# Altium schematic sheet Lockin.SchDoc
size A3; SheetNumber: 3; SheetTotal: 3
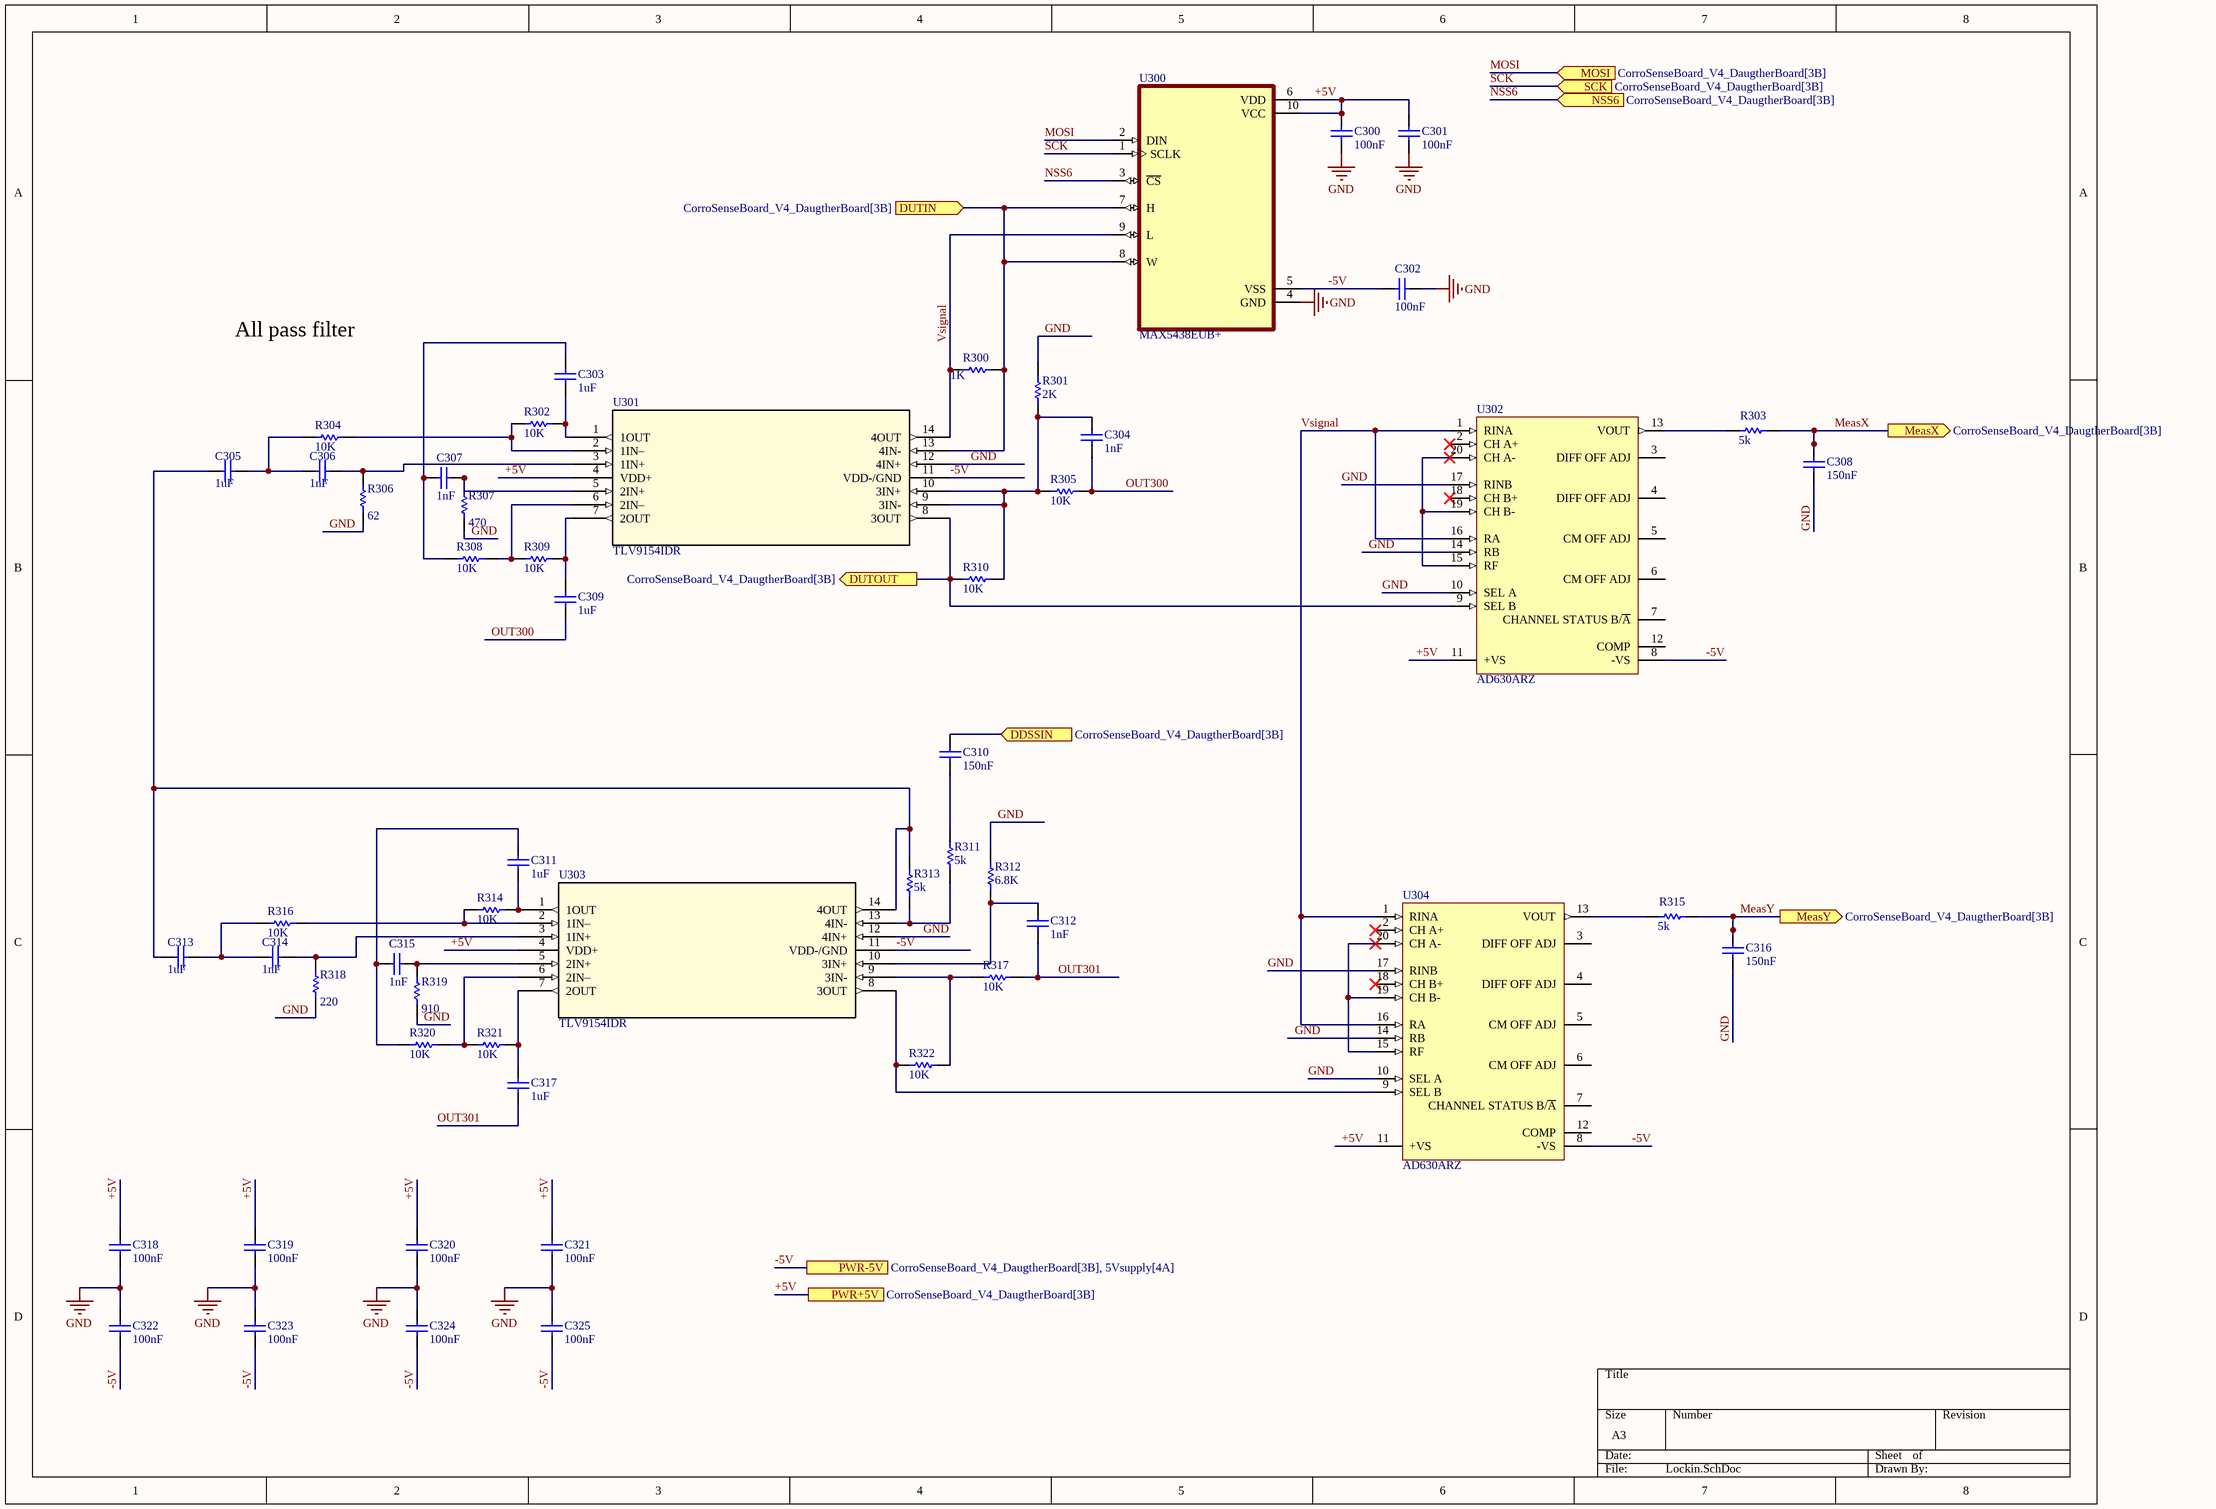
[diagram p0: Lockin.SchDoc]

## Parts
C300  100nF  [1608[0603]]
C301  100nF  [1608[0603]]
C302  100nF  [1608[0603]]
C303  1uF  [1608[0603]]
C304  1nF  [1608[0603]]
C305  1uF  [1608[0603]]
C306  1nF  [1608[0603]]
C307  1nF  [1608[0603]]
C308  150nF  [1608[0603]]
C309  1uF  [1608[0603]]
C310  150nF  [1608[0603]]
C311  1uF  [1608[0603]]
C312  1nF  [1608[0603]]
C313  1uF  [1608[0603]]
C314  1nF  [1608[0603]]
C315  1nF  [1608[0603]]
C316  150nF  [1608[0603]]
C317  1uF  [1608[0603]]
C318  100nF  [1608[0603]]
C319  100nF  [1608[0603]]
C320  100nF  [1608[0603]]
C321  100nF  [1608[0603]]
C322  100nF  [1608[0603]]
C323  100nF  [1608[0603]]
C324  100nF  [1608[0603]]
C325  100nF  [1608[0603]]
R300  1K  [1608[0603]]
R301  2K  [1608[0603]]
R302  10K  [1608[0603]]
R303  5k  [1608[0603]]
R304  10K  [1608[0603]]
R305  10K  [1608[0603]]
R306  62  [1608[0603]]
R307  470  [1608[0603]]
R308  10K  [1608[0603]]
R309  10K  [1608[0603]]
R310  10K  [1608[0603]]
R311  5k  [1608[0603]]
R312  6.8K  [1608[0603]]
R313  5k  [1608[0603]]
R314  10K  [1608[0603]]
R315  5k  [1608[0603]]
R316  10K  [1608[0603]]
R317  10K  [1608[0603]]
R318  220  [1608[0603]]
R319  910  [1608[0603]]
R320  10K  [1608[0603]]
R321  10K  [1608[0603]]
R322  10K  [1608[0603]]
U300  MAX5438EUB+  [SOP50P490X110-10N]
U301  TLV9154IDR  [SOIC127P600X175-14N]
U302  AD630ARZ  [SOIC127P1032X265-20N]
U303  TLV9154IDR  [SOIC127P600X175-14N]
U304  AD630ARZ  [SOIC127P1032X265-20N]

## Ports
DDSSIN (in, see CorroSenseBoard_V4_DaugtherBoard[3B]), DUTIN (in, see CorroSenseBoard_V4_DaugtherBoard[3B]), DUTOUT (out, see CorroSenseBoard_V4_DaugtherBoard[3B]), MeasX (out, see CorroSenseBoard_V4_DaugtherBoard[3B]), MeasY (out, see CorroSenseBoard_V4_DaugtherBoard[3B]), MOSI (in, see CorroSenseBoard_V4_DaugtherBoard[3B]), NSS6 (in, see CorroSenseBoard_V4_DaugtherBoard[3B]), PWR+5V (see CorroSenseBoard_V4_DaugtherBoard[3B]), PWR-5V (see CorroSenseBoard_V4_DaugtherBoard[3B], 5Vsupply[4A]), SCK (in, see CorroSenseBoard_V4_DaugtherBoard[3B])

## Nets
GND: C300.1 C301.1 C302.1 C308.1 C316.1 C318.1 C319.1 C320.1 C321.1 C322.2 C323.2 C324.2 C325.2 R301.1 R306.1 R307.1 R312.1 R318.1 R319.1 U300.4(GND) U301.12(4IN+) U302.10(SEL_A) U302.14(RB) U302.17(RINB) U303.12(4IN+) U304.10(SEL_A) U304.14(RB) U304.17(RINB)
+5V: C300.2 C301.2 C318.2 C319.2 C320.2 C321.2 U300.6(VDD) U300.10(VCC) U301.4(VDD+) U302.11(+VS) U303.4(VDD+) U304.11(+VS) ; port PWR+5V
-5V: C302.2 C322.1 C323.1 C324.1 C325.1 U300.5(VSS) U301.11(VDD-/GND) U302.8(-VS) U303.11(VDD-/GND) U304.8(-VS) ; port PWR-5V
DDSSIN: C310.2 ; port DDSSIN
DUTIN: R300.1 U300.7(H) U300.8(W) U301.13(4IN-) ; port DUTIN
DUTOUT: R310.2 U301.8(3OUT) U302.9(SEL_B) ; port DUTOUT
MeasX: C308.2 R303.1 ; port MeasX
MeasY: C316.2 R315.1 ; port MeasY
MOSI: U300.2(DIN) ; port MOSI
NSS6: U300.3(~{CS}) ; port NSS6
OUT300: C304.1 C309.1 R305.1
OUT301: C312.1 C317.1 R317.1
SCK: U300.1(SCLK) ; port SCK
Vsignal: R300.2 U300.9(L) U301.14(4OUT) U302.1(RINA) U302.16(RA) U304.1(RINA) U304.16(RA)
NetC303_1: C303.1 R302.1 U301.1(1OUT)
NetC303_2: C303.2 C307.1 R308.2
NetC304_2: C304.2 R301.2 R305.2 R310.1 U301.9(3IN-) U301.10(3IN+)
NetC305_1: C305.1 C313.1 R313.1 U303.14(4OUT)
NetC305_2: C305.2 C306.1 R304.2
NetC306_2: C306.2 R306.2 U301.3(1IN+)
NetC307_2: C307.2 R307.2 U301.5(2IN+)
NetC309_2: C309.2 R309.1 U301.7(2OUT)
NetC310_1: C310.1 R311.1
NetC311_1: C311.1 R314.1 U303.1(1OUT)
NetC311_2: C311.2 C315.1 R320.2
NetC312_2: C312.2 R312.2 U303.10(3IN+)
NetC313_2: C313.2 C314.1 R316.2
NetC314_2: C314.2 R318.2 U303.3(1IN+)
NetC315_2: C315.2 R319.2 U303.5(2IN+)
NetC317_2: C317.2 R321.1 U303.7(2OUT)
NetR302_2: R302.2 R304.1 U301.2(1IN–)
NetR303_2: R303.2 U302.13(VOUT)
NetR308_1: R308.1 R309.2 U301.6(2IN–)
NetR311_2: R311.2 R313.2 U303.13(4IN-)
NetR314_2: R314.2 R316.1 U303.2(1IN–)
NetR315_2: R315.2 U304.13(VOUT)
NetR317_2: R317.2 R322.1 U303.9(3IN-)
NetR320_1: R320.1 R321.2 U303.6(2IN–)
NetR322_2: R322.2 U303.8(3OUT) U304.9(SEL_B)
NetU302_15: U302.15(RF) U302.19(CH_B-) U302.20(CH_A-)
NetU304_15: U304.15(RF) U304.19(CH_B-) U304.20(CH_A-)

Not connected (* = marked no-connect by the designer): U302 2(CH_A+)* 3(DIFF_OFF_ADJ) 4(DIFF_OFF_ADJ) 5(CM_OFF_ADJ) 6(CM_OFF_ADJ) 7(CHANNEL_STATUS_B/~{A}) 12(COMP) 18(CH_B+)*; U304 2(CH_A+)* 3(DIFF_OFF_ADJ) 4(DIFF_OFF_ADJ) 5(CM_OFF_ADJ) 6(CM_OFF_ADJ) 7(CHANNEL_STATUS_B/~{A}) 12(COMP) 18(CH_B+)*

## Notes on the sheet
- All pass filter

## Library data of the parts
C300-C302 C318-C325 = Cap: CAP CER 25V X7R 0603; Manufacturer: Murata Electronics; MPN: GCJ188R71E104KA12D; Tolerance: ±10%; PackageReference: RAD-0.3; PackageDescription: Radial Cap, Thru-Hole; 2 Leads; 0.3 in Pin Spacing; Value: 100nF; Operating Temperature: -55°C ~ 125°C; Package / Case: 0603 (1608 Metric); Temperature Coefficient: X7R; Voltage - Rated: 25V
C303 C305 C309 C311 C313 = Cap: CAP CER 25V X7R 0603; Manufacturer: Murata Electronics; MPN: GCM188R71E105KA64D; Tolerance: ±10%; PackageReference: RAD-0.3; PackageDescription: Radial Cap, Thru-Hole; 2 Leads; 0.3 in Pin Spacing; Value: 1uF; Operating Temperature: -55°C ~ 125°C; Package / Case: 0603 (1608 Metric); Temperature Coefficient: X7R; Voltage - Rated: 25V
C304 C306 C307 C312 C314 C315 = Cap: CAP CER 25V X7R 0603; Manufacturer: KYOCERA AVX; MPN: 06033C102KAT2A; Tolerance: ±10%; PackageReference: RAD-0.3; PackageDescription: Radial Cap, Thru-Hole; 2 Leads; 0.3 in Pin Spacing; Value: 1nF; Operating Temperature: -55°C ~ 125°C; Package / Case: 0603 (1608 Metric); Temperature Coefficient: X7R; Voltage - Rated: 25V
C308 C310 C316 = Cap: CAP CER 25V X7R 0603; Manufacturer: Murata Electronics; MPN: GRM188R71E154KA01D; Tolerance: ±10%; PackageReference: RAD-0.3; PackageDescription: Radial Cap, Thru-Hole; 2 Leads; 0.3 in Pin Spacing; Value: 150nF; Operating Temperature: -55°C ~ 125°C; Package / Case: 0603 (1608 Metric); Temperature Coefficient: X7R; Voltage - Rated: 25V
C317 = Cap: CAP CER 25V X7R 0603; MPN: GCM188R71E105KA64D; Manufacturer: Murata Electronics; Tolerance: ±10%; PackageReference: RAD-0.3; PackageDescription: Radial Cap, Thru-Hole; 2 Leads; 0.3 in Pin Spacing; Value: 1uF; Operating Temperature: -55°C ~ 125°C; Package / Case: 0603 (1608 Metric); Temperature Coefficient: X7R; Voltage - Rated: 25V
R300 = Res1: RES SMD 2% 1.5W 0603; Manufacturer: YAGEO; MPN: RC0603FR-071KL; Published: 8-Jun-2000; LatestRevisionDate: 17-Jul-2002; LatestRevisionNote: Re-released for DXP Platform.; Publisher: Altium Limited; Value: 1K; Code_JEITA: Thick Film; Composition: Thick Film; Operating Temperature: -65°C ~ 155°C; Package: 0603 (1608 Metric); Power (Watts): 1.5W; Tolerance: 2%
R301 = Res1: RES SMD 2% 1.5W 0603; Manufacturer: YAGEO; MPN: AC0603FR-072KL; Published: 8-Jun-2000; LatestRevisionDate: 17-Jul-2002; LatestRevisionNote: Re-released for DXP Platform.; Publisher: Altium Limited; Value: 2K; Code_JEITA: Thick Film; Composition: Thick Film; Operating Temperature: -65°C ~ 155°C; Package: 0603 (1608 Metric); Power (Watts): 1.5W; Tolerance: 2%
R302 R304 R305 R308-R310 R314 R316 R317 R320-R322 = Res1: RES SMD 2% 1.5W 0603; Manufacturer: YAGEO; MPN: RC0603FR-0710KL; Published: 8-Jun-2000; LatestRevisionDate: 17-Jul-2002; LatestRevisionNote: Re-released for DXP Platform.; Publisher: Altium Limited; Value: 10K; Code_JEITA: Thick Film; Composition: Thick Film; Operating Temperature: -65°C ~ 155°C; Package: 0603 (1608 Metric); Power (Watts): 1.5W; Tolerance: 2%
R303 R311 R313 R315 = Res1: RES SMD 2% 1.5W 0603; Manufacturer: YAGEO; MPN: AC0603FR-134K99L; Published: 8-Jun-2000; LatestRevisionDate: 17-Jul-2002; LatestRevisionNote: Re-released for DXP Platform.; Publisher: Altium Limited; Value: 5k; Code_JEITA: Thick Film; Composition: Thick Film; Operating Temperature: -65°C ~ 155°C; Package: 0603 (1608 Metric); Power (Watts): 1.5W; Tolerance: 2%
R306 = Res1: RES SMD 2% 1.5W 0603; Manufacturer: YAGEO; MPN: AC0603FR-0762RL; Published: 8-Jun-2000; LatestRevisionDate: 17-Jul-2002; LatestRevisionNote: Re-released for DXP Platform.; Publisher: Altium Limited; Value: 62; Code_JEITA: Thick Film; Composition: Thick Film; Operating Temperature: -65°C ~ 155°C; Package: 0603 (1608 Metric); Power (Watts): 1.5W; Tolerance: 2%
R307 = Res1: RES SMD 2% 1.5W 0603; Manufacturer: YAGEO; MPN: RC0603FR-07470RL; Published: 8-Jun-2000; LatestRevisionDate: 17-Jul-2002; LatestRevisionNote: Re-released for DXP Platform.; Publisher: Altium Limited; Value: 470; Code_JEITA: Thick Film; Composition: Thick Film; Operating Temperature: -65°C ~ 155°C; Package: 0603 (1608 Metric); Power (Watts): 1.5W; Tolerance: 2%
R312 = Res1: RES SMD 2% 1.5W 0603; Manufacturer: YAGEO; MPN: RC0603FR-106K8L; Published: 8-Jun-2000; LatestRevisionDate: 17-Jul-2002; LatestRevisionNote: Re-released for DXP Platform.; Publisher: Altium Limited; Value: 6.8K; Code_JEITA: Thick Film; Composition: Thick Film; Operating Temperature: -65°C ~ 155°C; Package: 0603 (1608 Metric); Power (Watts): 1.5W; Tolerance: 2%
R318 = Res1: RES SMD 2% 1.5W 0603; Manufacturer: YAGEO; MPN: RC0603FR-10220RL; Published: 8-Jun-2000; LatestRevisionDate: 17-Jul-2002; LatestRevisionNote: Re-released for DXP Platform.; Publisher: Altium Limited; Value: 220; Code_JEITA: Thick Film; Composition: Thick Film; Operating Temperature: -65°C ~ 155°C; Package: 0603 (1608 Metric); Power (Watts): 1.5W; Tolerance: 2%
R319 = Res1: RES SMD 2% 1.5W 0603; Manufacturer: YAGEO; MPN: RC0603FR-07910RL; Published: 8-Jun-2000; LatestRevisionDate: 17-Jul-2002; LatestRevisionNote: Re-released for DXP Platform.; Publisher: Altium Limited; Value: 910; Code_JEITA: Thick Film; Composition: Thick Film; Operating Temperature: -65°C ~ 155°C; Package: 0603 (1608 Metric); Power (Watts): 1.5W; Tolerance: 2%
U300 = MAX5438EUB+: Manufacturer: Analog Devices / Maxim Integrated; MF: {'manufacturer': u'Analog Devices Inc./Maxim Integrated'}; Package: None; Price: None; Value: *; MP: MAX5438EUB+; Availability: Unavailable; MPN: MAX5438EUB+
U301 U303 = TLV2444CD: No Description Available; Mfr_Name: Texas Instruments; RefDes: RefDes; Type: Type; Manufacturer: Texas Instruments; MPN: TLV9154IDR
U302 U304 = ADI-AD630-RW-20: Consumer Circuit, PDSO20; Manufacturer: Analog Devices; Min Supply Voltage: 5V; Max Supply Voltage: 16.5V; Channels: 1; Case/Package: SOP; Max Operating Temperature: 85°C; Pins: 20; RoHS Compliant: Yes; Min Operating Temperature: -25°C; MPN: AD630ARZ